# EAGLE design Nanite 85 micro-b v1.0 (EAGLE 6.5.0)
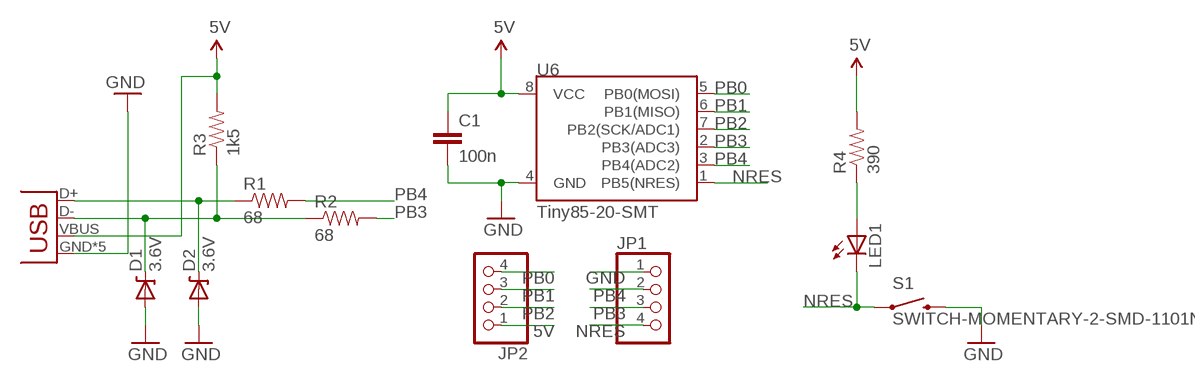
[diagram p0: schematic, sheet 1]

## Parts
C1  100n  CAP0805  [0805]
D1  3.6V  DIODE-ZENER-BZT52  [SOD-323]
D2  3.6V  DIODE-ZENER-BZT52  [SOD-323]
JP1  HEADER-1X4ROUND  [1X04_ROUND]
JP2  HEADER-1X4ROUND  [1X04_ROUND]
JP4  USB-MICROB-HOLE-ALLCONNECTED  [USB-MICROB-HOLES]
LED1  LEDCHIPLED_0805  [CHIPLED_0805]
R1  68  RESISTOR0805-RES  [0805]
R2  68  RESISTOR0805-RES  [0805]
R3  1k5  RESISTOR0805-RES  [0805]
R4  390  RESISTOR0805-RES  [0805]
S1  SWITCH-MOMENTARY-2-SMD-1101NE  [TACTILE-SWITCH-1101NE]
U6  Tiny85-20-SMT  ATTINY45TINY85-20-SMT  [SO08-EIAJ]

## Nets
5V [Power]: C1.1 JP2.1 JP4.VBUS R3.2 R4.2 U6.8(VCC)
GND [Power]: C1.2 D1.2(A) D2.2(A) JP1.1 JP4.GND JP4.MT1(GND) JP4.MT2(GND) JP4.P$1(GND) JP4.P$2(GND) S1.P$2 U6.4(GND)
N$1: D1.1(C) JP4.D- R2.1 R3.1
N$2: D2.1(C) JP4.D+ R1.1
N$3: LED1.A R4.1
NRES: JP1.4 LED1.C S1.P$1 U6.1(PB5(NRES))
PB0: JP2.4 U6.5(PB0(MOSI))
PB1: JP2.3 U6.6(PB1(MISO))
PB2: JP2.2 U6.7(PB2(SCK/ADC1))
PB3: JP1.3 R2.2 U6.2(PB3(ADC3))
PB4: JP1.2 R1.2 U6.3(PB4(ADC2))

## Library data of the parts
C1 = SparkFun-Capacitors:CAP: Capacitor Standard 0603 ceramic capacitor, and 0.1" leaded capacitor.
D1 D2 = SparkFun-DiscreteSemi:DIODE-ZENER: Zener Diode Production Part - 8199 3.4V Zener Voltage
JP1 JP2 = microbuilder:HEADER-1X4: PIN HEADER
JP4 = SparkFun-Connectors_tb:USB: USB Connectors USB-B-PTH is fully proven SKU : PRT-00139/CONN-08278 USB-miniB is fully proven SKU : PRT-00587 USB-A-PCB is untested. USB-A-H is throughly reviewed, but untested. Spark Fun Electronics SKU : PRT-00437 USB-B-SMT is throughly reviewed, but untested. Needs silkscreen touching up. USB-A-S has not been used/tested USB-MB-H has not been used/tested USB-MICROB has been used. CONN-09505
LED1 = led:LED: LED OSRAM: - CHIPLED LG R971, LG N971, LY N971, LG Q971, LY Q971, LO R971, LY R971 LH N974, LH R974 LS Q976, LO Q976, LY Q976 LO Q996 - Hyper CHIPLED LW Q18S LB Q993, LB Q99A, LB R99A - SideLED LS A670, LO A670, LY A670, LG A670, LP A670 LB A673, LV A673, LT A673, LW A673 LH A674 LY A675 LS A676, LA A676, LO A676, LY A676, LW A676 LS A679, LY A679, LG A679 - Hyper Micro SIDELED® LS Y876, LA Y876, LO Y876, LY Y876 LT Y87S - SmartLED LW L88C, LW L88S LB L89C, LB L89S, LG L890 LS L89K, LO L89K, LY L89K LS L896, LA L896, LO L896, LY L896 - TOPLED LS T670, LO T670, LY T670, LG T670, LP T670 LSG T670, LSP T670, LSY T670, LOP T670, LYG T670 LG T671, LOG T671, LSG T671 LB T673, LV T673, LT T673, LW T673 LH T674 LS T676, LA T676, LO T676, LY T676, LB T676, LH T676, LSB T676, LW T676 LB T67C, LV T67C, LT T67C, LS T67K, LO T67K, LY T67K, LW E67C LS E67B, LA E67B, LO E67B, LY E67B, LB E67C, LV E67C, LT E67C LW T67C LS T679, LY T679, LG T679 LS T770, LO T770, LY T770, LG T770, LP T770 LB T773, LV T773, LT T773, LW T773 LH T774 LS E675, LA E675, LY E675, LS T675 LS T776, LA T776, LO T776, LY T776, LB T776 LHGB T686 LT T68C, LB T68C - Hyper Mini TOPLED® LB M676 - Mini TOPLED Santana® LG M470 LS M47K, LO M47K, LY M47K Source: http://www.osram.convergy.de LUXEON: - LUMILED® LXK2-PW12-R00, LXK2-PW12-S00, LXK2-PW14-U00, LXK2-PW14-V00 LXK2-PM12-R00, LXK2-PM12-S00, LXK2-PM14-U00 LXK2-PE12-Q00, LXK2-PE12-R00, LXK2-PE12-S00, LXK2-PE14-T00, LXK2-PE14-U00 LXK2-PB12-K00, LXK2-PB12-L00, LXK2-PB12-M00, LXK2-PB14-N00, LXK2-PB14-P00, LXK2-PB14-Q00 LXK2-PR12-L00, LXK2-PR12-M00, LXK2-PR14-Q00, LXK2-PR14-R00 LXK2-PD12-Q00, LXK2-PD12-R00, LXK2-PD12-S00 LXK2-PH12-R00, LXK2-PH12-S00 LXK2-PL12-P00, LXK2-PL12-Q00, LXK2-PL12-R00 Source: www.luxeon.com KINGBRIGHT: KA-3528ASYC Source: www.kingbright.com
R1-R4 = SparkFun-Passives:RESISTOR: Resistor Basic schematic elements and footprints for 0603, 1206, and PTH resistors.
S1 = SparkFun-Electromechanical:SWITCH-MOMENTARY-2: Various NO switches- pushbuttons, reed, etc
U6 = SparkFun-DigitalIC:ATTINY45: Atmel 8-pin 2/4/8kB flash uC; PROD_ID: IC-09092

## Net classes
0 default: width 0.254 mm, clearance 0.152 mm
1 Power: width 0.254 mm, clearance 0.152 mm

## Board
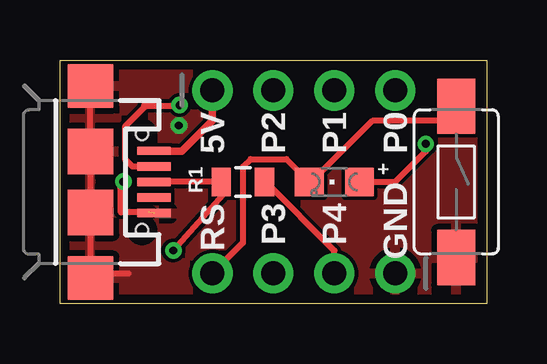
[diagram p1: board, top side]
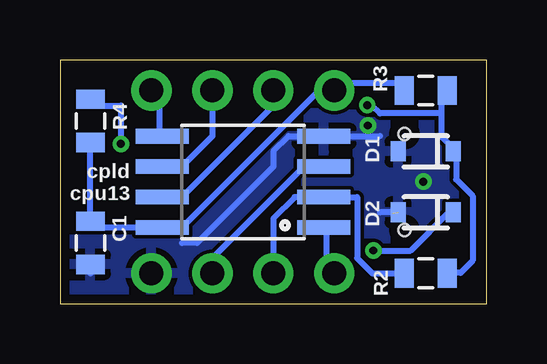
[diagram p2: board, bottom side, seen from below]

Size 17.78 x 10.16 mm. Coordinates in mm from the lower left corner, seen from the top.
Outline: 0,0 0,10.16 17.78,10.16 17.78,0 0,0
Copper layers (1*16): Top 0.0356mm / dielectric 1.5011mm / Bottom 0.0356mm
Design rules "LaenPCBOrder": minimum track width 6mil, minimum drill 13mil, track to track 6mil, track to pad 6mil, pad to pad 6mil, via to via 6mil, smd to smd 6mil, copper to edge 15mil, drill to drill 6mil, minimum pad ring 7mil, minimum via ring 7mil, stop-mask expansion 4mil, vias tented up to drill 0mil, thermal gap 10mil

### Footprints (pad centres in the part's own frame; a part is rotated, then mirrored left to right if it is on the bottom)
0805 = smd 0.8 x 1.2: 1 -0.9,0; 2 0.9,0
SOD-323 = smd 0.63 x 0.83: 1 -1.15,0; 2 1.15,0
1X04_ROUND = drill 1 pad 1.676: 1 -3.81,0; 2 -1.27,0; 3 1.27,0; 4 3.81,0
USB-MICROB-HOLES = smd 0.35 x 1.4: D+ 0,2.65; D- -0.65,2.65; GND 1.3,2.65; ID 0.65,2.65; VBUS -1.3,2.65 | smd 1.8 x 1.9: MT1 -4,0; MT2 4,0 | smd 1.9 x 1.9: P$1 -1.27,0; P$2 1.27,0 | hole 0.5: -2,2.15; 2,2.15
CHIPLED_0805 = smd 1.2 x 1.2: A 0,-1.05; C 0,1.05
TACTILE-SWITCH-1101NE = smd 2.3 x 1.6: P$1 -3.15,0; P$2 3.15,0
SO08-EIAJ = smd 0.61 x 2.21: 1 -1.905,-3.378; 2 -0.635,-3.378; 3 0.635,-3.378; 4 1.905,-3.378; 5 1.905,3.353; 6 0.635,3.353; 7 -0.635,3.353; 8 -1.905,3.353

### Placement (x,y rotation side)
C1  16.51,2.54 270 bottom
D1  2.54,6.35 180 bottom
D2  2.54,3.81 180 bottom
JP1  10.16,1.27 180 top
JP2  10.16,8.89 0 top
JP4  1.27,5.08 270 top
LED1  11.43,5.08 90 top
R1  7.62,5.08 0 top
R2  2.54,1.27 180 bottom
R3  2.54,8.89 180 bottom
R4  16.51,7.62 270 bottom
S1  16.51,5.08 270 top
U6  10.16,5.08 90 bottom

### Tracks (layer width: path | path; a pad name or v marks a point on that pad's centre or on a via)
5V
  Top 0.254: JP2.1 6.35,8.57 | 4.13,6.35 JP4.VBUS
  Top 0.305: 4.13,6.35 5.08,6.35 6.35,7.62 JP2.1
  Bottom 0.254: R4.2 C1.1 16.51,3.17 U6.8 12.7,3.17 6.99,8.89 JP2.1 6.03,9.21 3.81,9.21 3.49,8.89 R3.2
GND  (via drill 0.33)  (1 unrouted)
  Top 0.254: S1.P$2 16.51,2.54 | 16.51,1.91 S1.P$2 | 16.51,1.27 S1.P$2 | 1.27,1.27 2.86,1.27 | 4.13,3.81 JP4.GND | JP4.MT1 JP4.P$1 1.27,4.13 JP4.P$2 1.27,1.27 | 1.27,1.27 JP4.MT2
  Bottom 0.254: 12.7,2.54 12.06,2.54 8.89,5.71 8.89,6.35 8.26,6.99 U6.4 4.45,6.99 | 16.51,1.27 C1.2 | D2.2 4.45,3.81
  other vias: 2.64,5.09 4.95,7.43
  pour Bottom: 21.59,11.43 -1.27,11.43 -2.54,-2.54 20.32,-2.54
  pour Top: 19.05,11.43 -5.08,11.43 -5.08,-2.54 19.05,-1.27
N$1  (via drill 0.33)
  Top 0.254: JP4.D- 3.81,5.71 3.02,5.71 2.72,6.02 2.72,7.39 3.54,8.21 | 3.54,8.21 3.58,8.26 4.98,8.26 v4.98,8.28 | 3.49,8.26 3.54,8.21
  Bottom 0.254: 1.27,6.35 1.91,6.99 1.91,7.94 | 1.91,7.94 1.91,8.89 R3.1 | 1.27,6.35 D1.1 | 1.91,7.94 4.45,7.94 4.76,8.26 v4.98,8.28 | 1.27,6.35 1.27,5.18 0.58,4.5 0.58,1.8 1.09,1.29 1.61,1.29 R2.1
N$2  (via drill 0.33)
  Top 0.254: v4.72,2.22 6.99,4.76 6.99,5.08 R1.1 JP4.D+
  Bottom 0.254: v4.72,2.22 3.17,2.22 1.59,3.81 D2.1
N$3  (via drill 0.33)
  Top 0.254: LED1.A 13.97,5.08 15.24,6.35 v15.24,6.67
  Bottom 0.254: v15.24,6.67 15.24,8.26 16.51,8.26 R4.1
N$4
  Top 0.254: 3.81,3.81 2.54,3.81 2.54,5.08
NRES
  Top 0.254: S1.P$1 16.51,7.62 13.02,7.62 10.48,5.08 LED1.C | JP1.4 7.62,2.54 7.62,5.71 7.94,6.03 9.43,6.03 LED1.C | 10.16,5.08 LED1.C
  Bottom 0.254: JP1.4 6.67,1.27 6.67,3.17 U6.1
PB0
  Bottom 0.254: JP2.4 13.65,8.89 13.65,6.99 U6.5
PB1
  Bottom 0.254: JP2.3 11.43,6.99 12.7,5.71 U6.6
PB2
  Bottom 0.254: JP2.2 8.89,8.26 12.7,4.45 U6.7
PB3
  Bottom 0.254: JP1.3 8.89,3.56 8,4.45 U6.2 5.4,4.45 5.4,1.91 4.76,1.27 R2.2
PB4
  Top 0.254: JP1.2 11.43,2.22 8.57,5.08 R1.2
  Bottom 0.254: JP1.2 11.43,1.91 7.75,5.59 6.91,5.59 U6.3 6.99,5.71

### Text on the board
tPlace: 5V | P2 | P1 | P0 | R1 | + | GND | RS | P3 | P4
bPlace: R3 | D1 | R4 | cpld / cpu13 | D2 | C1 | R2